# EAGLE design mj-2506n daughterboard (EAGLE 9.0.1)
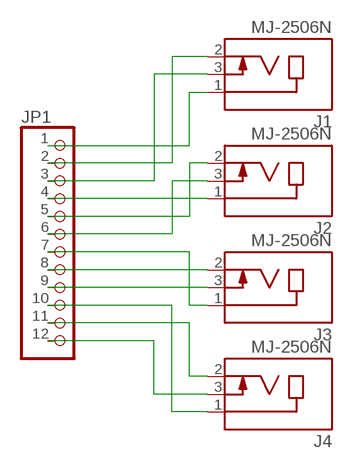
[diagram p0: schematic, sheet 1]

## Parts
J1  MJ-2506N  [CUI_MJ-2506N]
J2  MJ-2506N  [CUI_MJ-2506N]
J3  MJ-2506N  [CUI_MJ-2506N]
J4  MJ-2506N  [CUI_MJ-2506N]
JP1  PINHD-1X12  [1X12]

## Nets
N$1: J1.1 JP1.1
N$2: J1.3 JP1.3
N$3: J1.2 JP1.2
N$4: J2.1 JP1.4
N$5: J2.3 JP1.6
N$6: J2.2 JP1.5
N$7: J3.2 JP1.8
N$8: J3.3 JP1.9
N$9: J3.1 JP1.7
N$10: J4.1 JP1.10
N$11: J4.2 JP1.11
N$12: J4.3 JP1.12

## Library data of the parts
J1-J4 = MJ-2506N:MJ-2506N: 2.5 mm, Mono, Right Angle, Through Hole, Audio Jack Connector; MANUFACTURER: CUI INC; PART_REV: E; STANDARD: MANUFACTURER RECOMMENDATIONS
JP1 = pinhead:PINHD-1X12: PIN HEADER

## Board
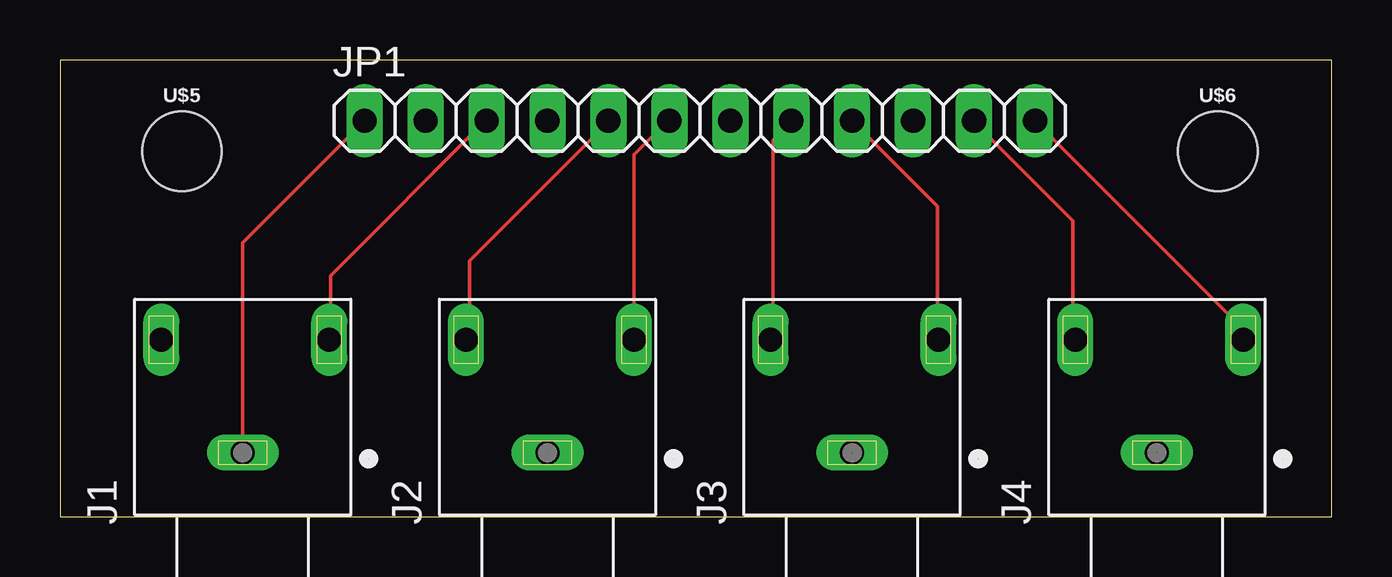
[diagram p1: board, top side]
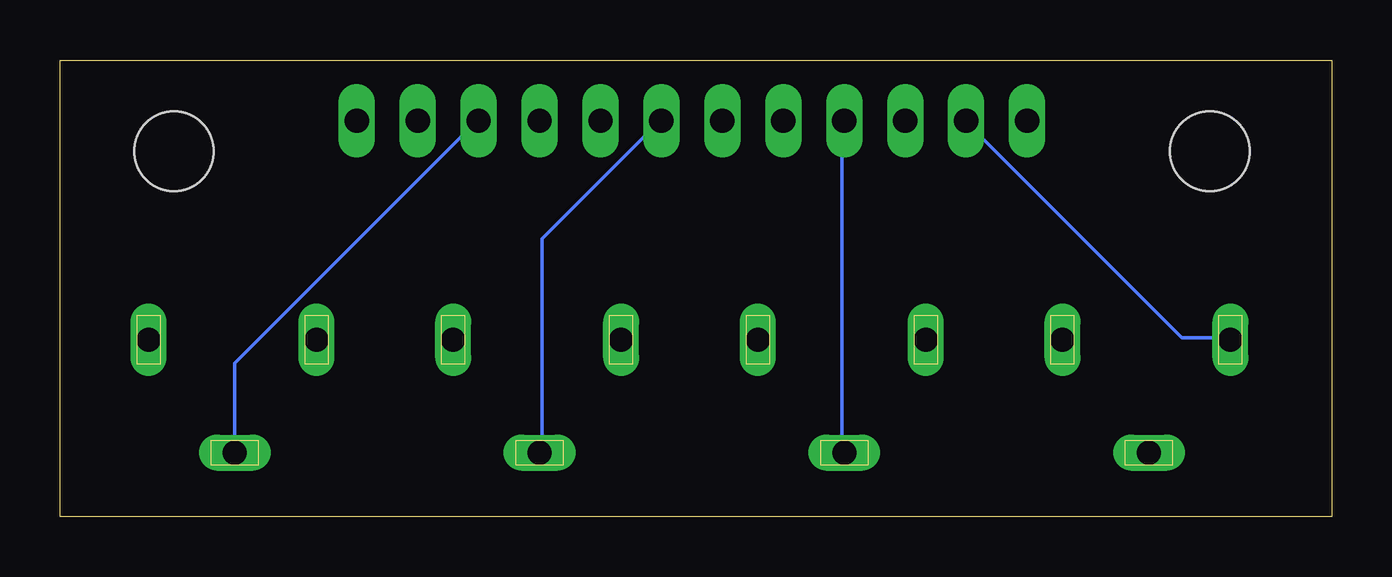
[diagram p2: board, bottom side, seen from below]

Size 53.01 x 19.04 mm. Coordinates in mm from the lower left corner, seen from the top.
Outline: 0,0 53.01,0 53.01,19.04 0,19.04 0,0
Copper layers (1*16): Top 0.035mm / dielectric 1.5mm / Bottom 0.035mm
Design rules "default": minimum track width 6mil, minimum drill 0.35mm, track to track 6mil, track to pad 6mil, pad to pad 6mil, via to via 6mil, smd to smd 6mil, copper to edge 40mil, drill to drill 6mil, minimum pad ring 10mil, minimum via ring 8mil, stop-mask expansion 4mil, vias tented up to drill 0mil, thermal gap 10mil

### Footprints (pad centres in the part's own frame; a part is rotated, then mirrored left to right if it is on the bottom)
CUI_MJ-2506N = drill 1 long: 1 -2.4,0; 2 2.3,3.4; 3 2.3,-3.6
1X12 = drill 1.016 long: 1 -13.97,0; 2 -11.43,0; 3 -8.89,0; 4 -6.35,0; 5 -3.81,0; 6 -1.27,0; 7 1.27,0; 8 3.81,0; 9 6.35,0; 10 8.89,0; 11 11.43,0; 12 13.97,0
STAND-OFF = hole 3.302: 0,0

### Placement (x,y rotation side)
J1  7.62,5.08 90 top
J2  20.32,5.08 90 top
J3  33.02,5.08 90 top
J4  45.72,5.08 90 top
JP1  26.67,16.51 0 top
U$5  [STAND-OFF]  5.08,15.24 0 top
U$6  [STAND-OFF]  48.26,15.24 0 top

### Tracks (layer width: path | path; a pad name or v marks a point on that pad's centre or on a via)
N$1
  Top 0.152: J1.1 7.62,11.43 JP1.1
N$2
  Top 0.152: J1.3 11.28,7.47 11.28,10.06 17.68,16.46 JP1.3
N$3
  Bottom 0.152: J1.2 4.27,7.47 6.25,7.47 15.24,16.46 JP1.2
N$4
  Bottom 0.152: J2.1 20.42,2.74 20.42,16.46 JP1.4
N$5
  Top 0.152: J2.3 23.93,7.47 23.93,15.09 25.3,16.46 JP1.6
N$6
  Top 0.152: J2.2 17.07,7.47 17.07,10.67 22.86,16.46 JP1.5
N$7
  Top 0.152: J3.2 29.72,7.47 29.72,15.7 30.48,16.46 JP1.8
N$8
  Top 0.152: JP1.9 36.58,12.95 36.58,7.47 J3.3
N$9
  Bottom 0.152: J3.1 32.92,2.74 32.92,11.58 28.04,16.46 JP1.7
N$10
  Bottom 0.152: J4.1 45.72,6.4 35.66,16.46 JP1.10
N$11
  Top 0.152: J4.2 42.22,7.47 42.22,12.34 38.1,16.46 JP1.11
N$12
  Top 0.152: JP1.12 49.23,7.92 49.23,7.47 J4.3